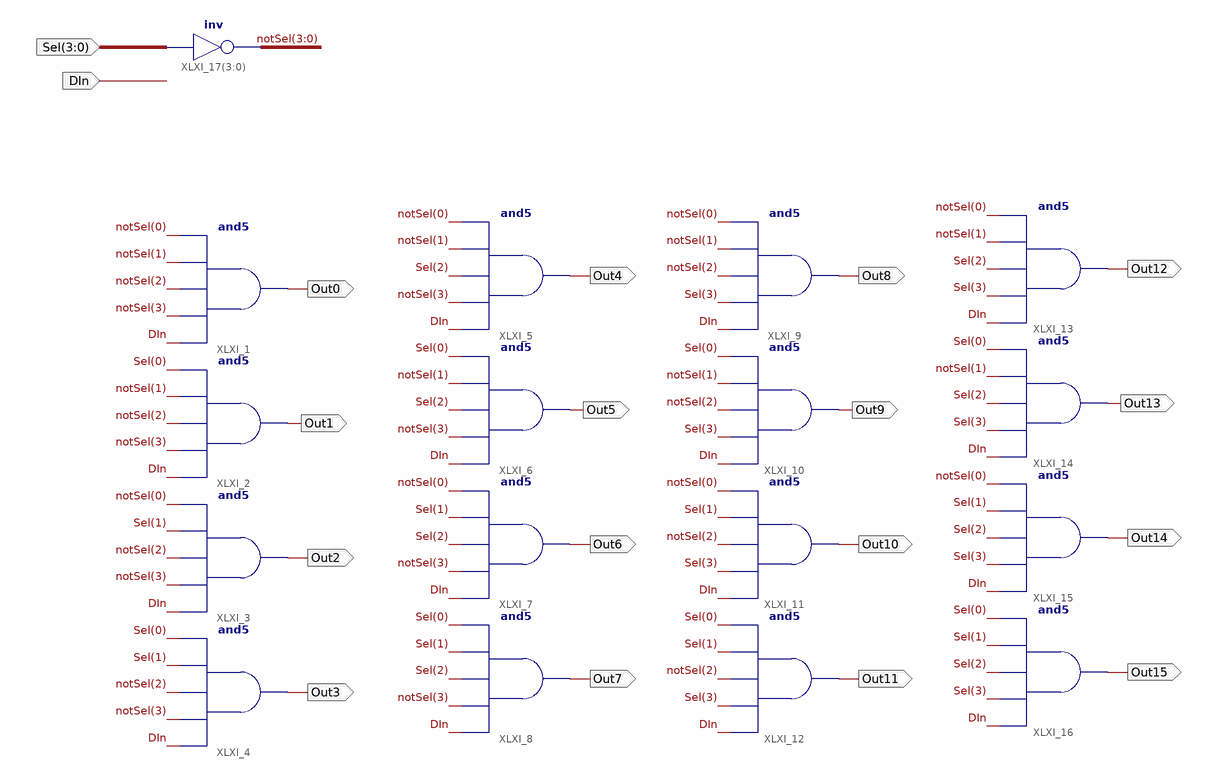
[diagram p0: schematic sheet 1]
// Xilinx ISE schematic Demux1to16.sch (spartan3e) as structural Verilog: 17 symbols, 18 ports
module Demux1to16 (
  input  [3:0] Sel,
  input  DIn,
  output Out0,
  output Out1,
  output Out2,
  output Out3,
  output Out7,
  output Out6,
  output Out5,
  output Out4,
  output Out11,
  output Out10,
  output Out9,
  output Out8,
  output Out15,
  output Out14,
  output Out13,
  output Out12
);

  wire [3:0] notSel;

  and XLXI_1 (Out0, DIn, notSel[3], notSel[2], notSel[1], notSel[0]);
  and XLXI_2 (Out1, DIn, notSel[3], notSel[2], notSel[1], Sel[0]);
  and XLXI_3 (Out2, DIn, notSel[3], notSel[2], Sel[1], notSel[0]);
  and XLXI_4 (Out3, DIn, notSel[3], notSel[2], Sel[1], Sel[0]);
  and XLXI_5 (Out4, DIn, notSel[3], Sel[2], notSel[1], notSel[0]);
  and XLXI_6 (Out5, DIn, notSel[3], Sel[2], notSel[1], Sel[0]);
  and XLXI_7 (Out6, DIn, notSel[3], Sel[2], Sel[1], notSel[0]);
  and XLXI_8 (Out7, DIn, notSel[3], Sel[2], Sel[1], Sel[0]);
  and XLXI_9 (Out8, DIn, Sel[3], notSel[2], notSel[1], notSel[0]);
  and XLXI_10 (Out9, DIn, Sel[3], notSel[2], notSel[1], Sel[0]);
  and XLXI_11 (Out10, DIn, Sel[3], notSel[2], Sel[1], notSel[0]);
  and XLXI_12 (Out11, DIn, Sel[3], notSel[2], Sel[1], Sel[0]);
  and XLXI_13 (Out12, DIn, Sel[3], Sel[2], notSel[1], notSel[0]);
  and XLXI_14 (Out13, DIn, Sel[3], Sel[2], notSel[1], Sel[0]);
  and XLXI_15 (Out14, DIn, Sel[3], Sel[2], Sel[1], notSel[0]);
  and XLXI_16 (Out15, DIn, Sel[3], Sel[2], Sel[1], Sel[0]);
  assign notSel = ~Sel;  // inv XLXI_17[3..0], 4 bits wide
endmodule
